# Altium schematic sheet 05-LED-RED.SchDoc: Red LEDs
size A; Revision: A; SheetNumber: 5; SheetTotal: 10; ECE315_Project_Name: ECE315 F23 Wack-A-Mole
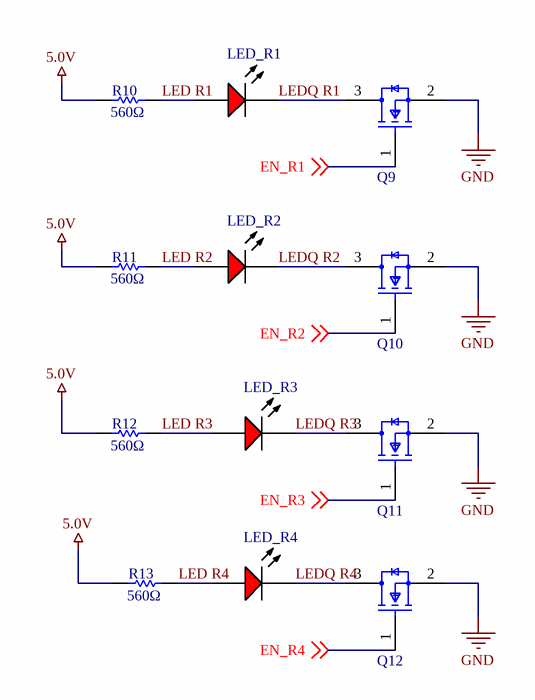
[diagram p0: 05-LED-RED.SchDoc]

## Parts
LED_R1  SML-LX1206IC-TR  [LUMX-SML-LX1206IC_V]  (value not drawn)
LED_R2  SML-LX1206IC-TR  [LUMX-SML-LX1206IC_V]  (value not drawn)
LED_R3  SML-LX1206IC-TR  [LUMX-SML-LX1206IC_V]  (value not drawn)
LED_R4  SML-LX1206IC-TR  [LUMX-SML-LX1206IC_V]  (value not drawn)
Q9  2N7002-7-F  [FP-SOT23-MFG]  (value not drawn)
Q10  2N7002-7-F  [FP-SOT23-MFG]  (value not drawn)
Q11  2N7002-7-F  [FP-SOT23-MFG]  (value not drawn)
Q12  2N7002-7-F  [FP-SOT23-MFG]  (value not drawn)
R10  560Ω  [RESC3216X70X50LL05T20]
R11  560Ω  [RESC3216X70X50LL05T20]
R12  560Ω  [RESC3216X70X50LL05T20]
R13  560Ω  [RESC3216X70X50LL05T20]

## Nets
5.0V: R10.1 R11.1 R12.1 R13.1
GND: Q9.2(S) Q10.2(S) Q11.2(S) Q12.2(S)
EN_R1: Q9.1(G) ; off-sheet EN_R1
EN_R2: Q10.1(G) ; off-sheet EN_R2
EN_R3: Q11.1(G) ; off-sheet EN_R3
EN_R4: Q12.1(G) ; off-sheet EN_R4
LED R1: LED_R1.1(A) R10.2
LED R2: LED_R2.1(A) R11.2
LED R3: LED_R3.1(A) R12.2
LED R4: LED_R4.1(A) R13.2
LEDQ R1: LED_R1.2(K) Q9.3(D)
LEDQ R2: LED_R2.2(K) Q10.3(D)
LEDQ R3: LED_R3.2(K) Q11.3(D)
LEDQ R4: LED_R4.2(K) Q12.3(D)

## Notes on the sheet
- Title:
- Size:
- A
- Project
- Rev:
- Sheet:
- of
- College of Engineering
- 1415 Engineering Drive
- Madison, WI 53706

## Library data of the parts
LED_R1-LED_R4 = CMP-2000-07123-1: LED Red, 65 mW, -40 to 85 degC, 2-Pin SMD, RoHS, Tape and Reel; Manufacturer: Lumex; Manufacturer Part Number 1: SMLLX1206ICTR; LED Material: GaAsP; Peak Wavelength: 635nm; Number of LEDs: 1; Viewing Angle: 160; Reverse Voltage: 5(Min)V; Lens Appearance: ColorlessNonDiffused; Intensity: 6mcd; Pin_Count: 2; Lens Color: Colorless,Clear; Forward Voltage: 2.6V; Test Current: 20mA; Lens Style: Clear,Diffused,Colorless,Rectangular; Forward Current: 100mA; Lens Transparency: Clear; Power Rating: 65mW; Voltage Rating (DC): 2V; Current Rating: 25mA; Lens Size: 1.5mm; Approvals: UL,CSA; Lens Dimensions: 2x1.6x0.5mm; Mounting: SurfaceMount; ECCN: EAR99; RoHS: Unknown; Package Description: 2-Pin Surface Mount Device, Body 3.2 x 1.5 mm; Mounting Technology: SurfaceMount; Dominant Wavelength: N/A; Supplier_Package: SMD; Supplier Standard Pack: 3,000; Color: Red; Dimension: 3.2x1.6x1.1mm; HTS: 8541402000; Part No: SML-LX1206IC-TR; Family: SML-LX1206IC; Supplier: Lumex; Datasheet URL: http://www.lumex.com/content/files/ProductAttachment/SML-LX1206IC-TR.pdf; Package Reference: SML-LX1206IC; Manufacturer URL: http://www.lumexinstruments.com/; Type: Uni-Color; Operating Temperature: -25to85C; Packaging: TapeandReel; Datasheet Version: Rev. J, 08/2012; Supplier 1: Digi-Key; Supplier Part Number 1: 67-1356-1-ND; Manufacturer 1: Lumex; Category: LEDs; Stock 1: 113609; Pricing 1: 1=0.39000, 10=0.30600, 100=0.13730, 500=0.12402, 1000=0.10187 (USD); Mount: Surface Mount; Case/Package: 1206; Number of Pins: 2; Case Code (Metric): 3216; Case Code (Imperial): 1206; Min Operating Temperature: -40°C; Max Operating Temperature: 85°C; Luminous Intensity: 6mcd; Package Quantity: 3000; Wavelength: 635nm; Illumination Color: Red; Series: -; Moisture Sensitivity Level: 2; Voltage Rating: 2V; Length: 3.2mm; Width: 1.6mm; Height: 1.1mm; Lead Free: Lead Free; Reach SVHC Compliant: Yes; ComponentLink1URL: https://datasheet.ciiva.com/12400/sml-lx1206ic-tr-112319-12400827.pdf?src-supplier=Mouser; ComponentLink1Description: https://datasheet.ciiva.com/12400/sml-lx1206ic-tr-112319-12400827.pdf?src-supplier=Mouser; ComponentLink2URL: https://datasheet.ciiva.com/16199/sml-lx1206ic-tr-16199616.pdf?src-supplier=Future+Electronics; ComponentLink2Description: https://datasheet.ciiva.com/16199/sml-lx1206ic-tr-16199616.pdf?src-supplier=Future+Electronics; ComponentLink3URL: https://datasheet.ciiva.com/2110/sml-lx1206ic-tr-2110300.pdf?src-supplier=Digi-Key; ComponentLink3Description: https://datasheet.ciiva.com/2110/sml-lx1206ic-tr-2110300.pdf?src-supplier=Digi-Key; ComponentLink4URL: https://datasheet.ciiva.com/2110/sml-lx1206ic-tr-2110301.pdf?src-supplier=Digi-Key; ComponentLink4Description: https://datasheet.ciiva.com/2110/sml-lx1206ic-tr-2110301.pdf?src-supplier=Digi-Key; ComponentLink5URL: https://datasheet.ciiva.com/2110/sml-lx1206ic-tr-2110302.pdf?src-supplier=Digi-Key; ComponentLink5Description: https://datasheet.ciiva.com/2110/sml-lx1206ic-tr-2110302.pdf?src-supplier=Digi-Key; ComponentLink6URL: https://datasheet.ciiva.com/30187/sml-lx1206ic-tr-30187578.pdf?src-supplier=Onlinecomponents.com; ComponentLink6Description: https://datasheet.ciiva.com/30187/sml-lx1206ic-tr-30187578.pdf?src-supplier=Onlinecomponents.com; ComponentLink7URL: https://datasheet.ciiva.com/8072/195796-8072871.pdf?src-supplier=Element14; ComponentLink7Description: https://datasheet.ciiva.com/8072/195796-8072871.pdf?src-supplier=Element14; ComponentLink8URL: https://datasheet.ciiva.com/8073/195796-8073097.pdf?src-supplier=Element14; ComponentLink8Description: https://datasheet.ciiva.com/8073/195796-8073097.pdf?src-supplier=Element14; ComponentLink9URL: https://datasheet.ciiva.com/15967/sml-lx1206ic-tr-15967210.pdf?src-supplier=Onlinecomponents.com; ComponentLink9Description: https://datasheet.ciiva.com/15967/sml-lx1206ic-tr-15967210.pdf?src-supplier=Onlinecomponents.com; Supplier 2: Newark; Supplier Part Number 2: 80K7325
Q9-Q12 = CMP-2000-04929-2: MOSFET N-CH 60V 115MA SOT23-3; Turn-On Delay Time: 7ns; Turn-Off Delay Time: 11ns; Drain to Source Resistance: 7.5R; Rise Time: 3ns; Drain to Source Breakdown Voltage: 70V; Input Capacitance: 50pF; Number of Elements: 1; Power Dissipation: 540mW; Max Power Dissipation: 300mW; Fall Time: 5.6ns; Gate to Source Voltage (Vgs): 20V; Threshold Voltage: 2.5V; Element Configuration: Single; Termination: SMD/SMT; Weight: 0.000282oz; Radiation Hardening: No; Max Operating Temperature: 150°C; On-State Resistance: 7.5R; Mount: Surface Mount; Current Rating: 115mA; Contact Plating: Tin; Lead Free: Lead Free; Min Operating Temperature: -55°C; Number of Pins: 3; REACH SVHC: No SVHC; Drain to Source Voltage (Vdss): 60V; Width: 1.3mm; Package Quantity: 3000; Length: 2.9mm; Case/Package: SOT-23; Number of Channels: 1; Dual Supply Voltage: 60V; Packaging: Tape and Reel; Height: 1mm; Voltage Rating (DC): 60V; Nominal Vgs: 2.5V; Continuous Drain Current (ID): 115mA; Voltage: 60V; Rds On Max: 7.5R
R10-R13 = CMP-2003-00856-1: Part Number: ERJ8ENF5600V; Manufacturer: Panasonic